# Altium project quad-voice-analog-synth.PrjPcb
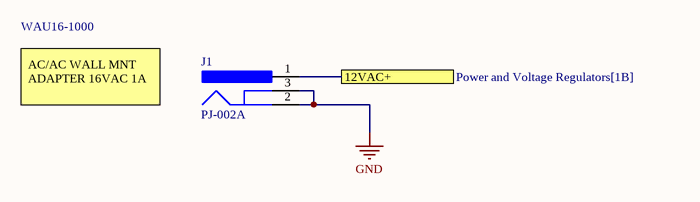
[diagram p0: Connectors.SchDoc]
4 sheets, 32 parts. Net scope: flat (ports and power ports of the same name join across sheets).
Sheets:
  Cover.SchDoc
  Connectors.SchDoc
  Power and Voltage Regulators.SchDoc
  Oscillator Core.SchDoc

## Sheet Cover.SchDoc
size A; SheetNumber: 1; SheetTotal: 1

## Sheet Connectors.SchDoc
size A; SheetNumber: 2; SheetTotal: 3

### Parts
J1  PJ-002A  [CUI-PJ-002A_V]

### Ports
12VAC+ (see Power and Voltage Regulators[1B])

### Nets
GND: J1.2 J1.3
NetD1_2: J1.1 ; port 12VAC+

### Notes on the sheet
- WAU16-1000
- AC/AC WALL MNT ADAPTER 16VAC 1A

### Library data of the parts
J1 = PJ-002A: CONN PWR JACK 2X5.5MM SOLDER; Manufacturer: CUIInc.; Connector Type: DCPowerJack; Brand: CUI; Inside Contact Diameter: 2mm; Voltage Rating: 24V; Mounting Angle: Right; Outside Contact Diameter: 6.5mm; Current Rating: 2.5A; Insulation Resistance: 50MOhms; Description: 12V, 1A, 2mm Dia; Option: General Purpose; Rated Current (Power): 1A; DIN Conformance: No; Contact Gender: Male; Datasheet Version: Rev. 1.03, 04/2016; Housing Material: PolybutyleneTerephthalate(PBT); Operating Temperature Range: -25Cto+85C; Termination Style: ThroughHole; Product Category: DCPowerConnectors; Mounting Technology: ThroughHole; Mounting Style: ThroughHole; Factory Pack Quantity: 500; Contact Plating: Nickel; Package Reference: PJ-002A; Package Description: 3-Pin Through Hole Device, Body 14.4 x 9 mm, Height 11 mm; Flammability Rating: UL94V-0; Manufacturer URL: http://www.cui.com/; Product: Jacks; Contact Material: Copper; Datasheet URL: http://www.cui.com/product/resource/pj-002a.pdf; RoHS: True; Supplier: Mouser; Supplier Part Number: 490-PJ-002A; Manufacturer Part Number: PJ-002A; Category: Uncategorized; Contact Finish - Mating: NOT SPECIFIED; Body/Shell Style: JACK; Termination: Solder; Pin Diameter: 2mm; Reach SVHC Compliant: Yes; RoHS Compliant: Yes; IEC Conformance: No; MIL Conformance: No; ComponentLink1URL: https://datasheet.ciiva.com:443/pdfs/VipMasterIC/IC/CUIS/CUIS-S-A0007606357/CUIS-S-A0007606357-1.pdf?src-supplier=IHS+Markit; ComponentLink1Description: https://datasheet.ciiva.com:443/pdfs/VipMasterIC/IC/CUIS/CUIS-S-A0007606357/CUIS-S-A0007606357-1.pdf?src-supplier=IHS+Markit; ComponentLink2URL: http://www.mouser.com/ds/2/670/pj-002a-515880.pdf?src-supplier=Mouser; ComponentLink2Description: http://www.mouser.com/ds/2/670/pj-002a-515880.pdf?src-supplier=Mouser; ComponentLink3URL: https://www.cui.com/product/resource/digikeypdf/pj-002a.pdf?src-supplier=Digikey; ComponentLink3Description: https://www.cui.com/product/resource/digikeypdf/pj-002a.pdf?src-supplier=Digikey; ComponentLink4URL: http://www.cui.com/Product/Resource/FuturePDF/PJ-002A.pdf?src-supplier=Future+Electronics; ComponentLink4Description: http://www.cui.com/Product/Resource/FuturePDF/PJ-002A.pdf?src-supplier=Future+Electronics

## Sheet Power and Voltage Regulators.SchDoc
size A; SheetNumber: 3; SheetTotal: 2
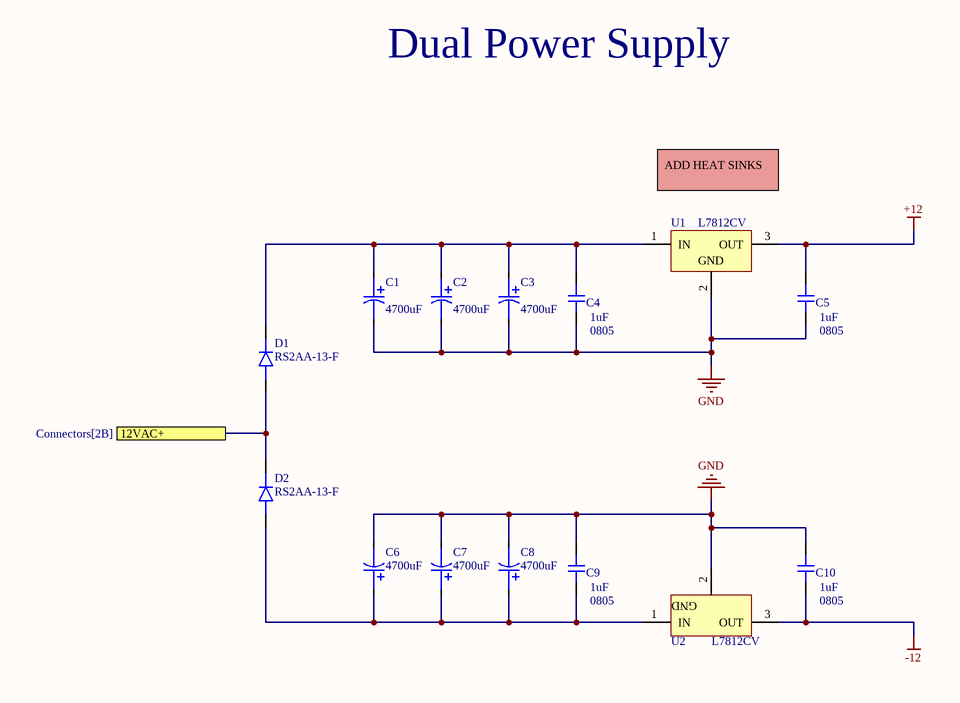
[diagram p1: Power and Voltage Regulators.SchDoc]

### Parts
C1  value 4700uF  [Radial Capacitor 7.5mm Pitch]  (hidden comment: 478CKS035M)
C2  value 4700uF  [Radial Capacitor 7.5mm Pitch]  (hidden comment: 478CKS035M)
C3  value 4700uF  [Radial Capacitor 7.5mm Pitch]  (hidden comment: 478CKS035M)
C4  value 1uF  Case/Package: 0805  [0805-CAP]  (hidden comment: Ceramic Capacitor)
C5  value 1uF  Case/Package: 0805  [0805-CAP]  (hidden comment: Ceramic Capacitor)
C6  value 4700uF  [Radial Capacitor 7.5mm Pitch]  (hidden comment: 478CKS035M)
C7  value 4700uF  [Radial Capacitor 7.5mm Pitch]  (hidden comment: 478CKS035M)
C8  value 4700uF  [Radial Capacitor 7.5mm Pitch]  (hidden comment: 478CKS035M)
C9  value 1uF  Case/Package: 0805  [0805-CAP]  (hidden comment: Ceramic Capacitor)
C10  value 1uF  Case/Package: 0805  [0805-CAP]  (hidden comment: Ceramic Capacitor)
D1  RS2AA-13-F  [DIOM4326X23N]
D2  RS2AA-13-F  [DIOM4326X23N]
U1  L7812CV  [TO220]
U2  L7812CV  [TO220]

### Ports
12VAC+ (see Connectors[2B])

### Nets
+12: C5.1 U1.3(OUT)
-12: C10.2 U2.3(OUT)
GND: C1.1 C2.1 C3.1 C4.2 C5.2 C6.1 C7.1 C8.1 C9.1 C10.1 U1.2(GND) U2.2(GND)
NetC1_2: C1.2 C2.2 C3.2 C4.1 D1.1 U1.1(IN)
NetC6_2: C6.2 C7.2 C8.2 C9.2 D2.2 U2.1(IN)
NetD1_2: D1.2 D2.1 ; port 12VAC+

### Notes on the sheet
- Dual Power Supply
- ADD HEAT SINKS

### Library data of the parts
C1-C3 C6-C8 = 478CKS035M: Aluminum Electrolytic Capacitors - Leaded 4700uF 35 Volts 20% LYTICS/IC; Manufacturer: Cornell Dubilier; Supplier: Newark; Supplier Part Number: 84M5175; Manufacturer Part Number: 478CKS035M; RoHS: Yes; Category: Capacitors; Stock: 101; Pricing: 1=1.58, 10=1.45, 25=1.45, 50=1.45, 100=1.34, 500=1.34 (USD); ComponentLink1URL: https://datasheet.ciiva.com/16317/ckr-cks-16317831.pdf?src-supplier=Future+Electronics; ComponentLink1Description: https://datasheet.ciiva.com/16317/ckr-cks-16317831.pdf?src-supplier=Future+Electronics
C4 C5 C9 C10 = Cap: Ceramic Capacitor, Multilayer, Ceramic, 50V, 10% +Tol, 10% -Tol, X7R, 15% TC, 1uF, Surface Mount, 0805; Manufacturer: Samsung; Manufacturer Part Number: CL21B105KBFNNNE; Multilayer: Yes; Supplier: Avnet; Supplier Part Number: CL21B105KBFNNNE; RoHS: Yes; Category: Ceramic Capacitors; Stock: 160000; Pricing: 2000=0.01319, 4000=0.01289, 8000=0.01258, 12000=0.01228, 16000=0.01198 (USD); Mounting Technology: Surface Mount; Pins: 2; Dielectric Material: Ceramic; Package Shape: Rectangular; Terminal Finish: Nickel; Min Operating Temperature: -55°C; Max Operating Temperature: 125°C; JESD-609 Code: e3; Capacitor Type: Ceramic; Tolerance  (fill in as +-): 10%; Package Style: SMTMeter; Packaging: Tape and Reel; Tolerance (fill in as +-): 10%; Rated DC Voltage (URdc): 50V; Temperature Characteristics Code: X7R; Termination: Wraparound; Length: 2mm; Width: 1.25mm; Height: 1.35mm; Reach SVHC Compliant: Yes; RoHS Compliant: Yes; ComponentLink1URL: https://datasheet.ciiva.com:443/pdfs/VipMasterIC/IC/SEMS/SEMS-S-A0008524728/SEMS-S-A0008523023-1.pdf?src-supplier=IHS+Markit; ComponentLink1Description: https://datasheet.ciiva.com:443/pdfs/VipMasterIC/IC/SEMS/SEMS-S-A0008524728/SEMS-S-A0008523023-1.pdf?src-supplier=IHS+Markit; ComponentLink2URL: https://media.digikey.com/pdf/Data%20Sheets/Samsung%20PDFs/CL_Series_MLCC_ds.pdf?src-supplier=Digikey; ComponentLink2Description: https://media.digikey.com/pdf/Data%20Sheets/Samsung%20PDFs/CL_Series_MLCC_ds.pdf?src-supplier=Digikey; ComponentLink3URL: http://www.farnell.com/datasheets/2710563.pdf?src-supplier=Farnell; ComponentLink3Description: http://www.farnell.com/datasheets/2710563.pdf?src-supplier=Farnell; ComponentLink4URL: https://datasheet.octopart.com/CL21B105KBFNNNE-Samsung-Electro-Mechanics-datasheet-11733377.pdf?src-supplier=Future+Electronics; ComponentLink4Description: https://datasheet.octopart.com/CL21B105KBFNNNE-Samsung-Electro-Mechanics-datasheet-11733377.pdf?src-supplier=Future+Electronics
D1 D2 = RS2AA-13-F: Rectifier Diode, 1 Phase, 1 Element, 1.5A, 50V V(RRM), Silicon; Manufacturer: Diodes; Package Body Material: Plastic; Application(s): EFFICIENCY; Forward Voltage: 1.3V; Non-rep Pk Forward Current-Max: 50A; Number of Elements: 1; Reverse Recovery Time-Max: 0.15us; Time @ Peak Reflow Temperature-Max (s): 40s; Qualification Status: Not Qualified; Supplier: Newark; Supplier Part Number: 29AK5192; Manufacturer Part Number: RS2AA-13-F; RoHS: Yes; Category: Rectifier Diodes; Stock: 4870; Pricing: 5=0.381, 10=0.303, 25=0.264, 50=0.226, 100=0.187, 250=0.181, 500=0.175, 1000=0.124 (USD); Pins: 2; Diode Element Material: SILICON; Package Shape: Rectangular; Terminal Finish: Tin; Min Operating Temperature: -65°C; Max Operating Temperature: 150°C; JESD-609 Code: e3; Diode Type: RECTIFIER; JESD-30 Code: R-PDSO-C2; Moisture Sensitivity Level: 1; Number of Phases: 1; Max Output current: 1.5A; Package Style: SMALL OUTLINEMeter; Peak Reflow Temperature (Cel): 260°C; Rep Pk Reverse Voltage-Max: 50V; Surface Mount: Yes; Terminal Form: C BEND; Terminal Position: DUAL; RoHS Compliant: Yes; Reach SVHC Compliant: No; ComponentLink1URL: https://datasheet.ciiva.com:443/pdfs/VipMasterIC/IC/DIOD/DIODS13030/DIODS13030-1.pdf?src-supplier=IHS+Markit; ComponentLink1Description: https://datasheet.ciiva.com:443/pdfs/VipMasterIC/IC/DIOD/DIODS13030/DIODS13030-1.pdf?src-supplier=IHS+Markit; ComponentLink2URL: https://datasheet.ciiva.com/16483/ds15004-16483689.pdf?src-supplier=Future+Electronics; ComponentLink2Description: https://datasheet.ciiva.com/16483/ds15004-16483689.pdf?src-supplier=Future+Electronics
U1 U2 = L7812CV: Fixed Positive Standard Regulator, 12VBIPolar, PSFM3; Manufacturer: STMicroelectronics; Max Supply Voltage: 30V; Min Input Voltage: 14.5V; Channels: 1; Output Current1-Max: 1.5A; Output Voltage1-Max: 12.6V; Output Voltage1-Min: 11.4V; Output Voltage1-Nom: 12V; Regulator Type: FIXED POSITIVE SINGLE OUTPUT STANDARD REGULATOR; Surface Mount: No; Qualification Status: Not Qualified; PackageDescription: TO, Thru-Hole, Vertical, Heatsink Mounted; 3 In-Line Leads; Pitch 2.54 mm; ComponentLink3URL: http://www.st.com/internet/com/TECHNICAL_RESOURCES/TECHNICAL_LITERATURE/PACKAGE_INFORMATION/CD00004649.pdf; ComponentLink1URL: http://www.st.com; ComponentLink2Description: Datasheet; ComponentLink3Description: Package Specification; ComponentLink2URL: http://www.st.com/internet/com/TECHNICAL_RESOURCES/TECHNICAL_LITERATURE/DATASHEET/CD00000444.pdf; DatasheetVersion: 16/11/2011; PackageVersion: ver3.0; PackageReference: TO220; ComponentLink1Description: Manufacturer URL; Supplier: Mouser; Supplier Part Number: 511-L7812CV; Manufacturer Part Number: L7812CV; RoHS: Yes; Category: Voltage Regulators - Linear; Stock: 31967; Pricing: 1=0.6, 10=0.465, 50=0.465, 100=0.401, 250=0.381, 500=0.339, 1000=0.289, 2000=0.264, 5000=0.259, 10000=0.258 (USD); Pins: 3; Package Shape: Rectangular; Terminal Finish: Tin; JESD-609 Code: e3; Operating Temperature, TJ-Max: 125°C; Operating Temperature, TJ-Min: 0°C; Package Style: FLANGE MOUNTMeter; Technology: BIPOLAR; Terminal Form: Through Hole; Terminal Position: SINGLE; RoHS Compliant: Yes; Reach SVHC Compliant: No; ComponentLink4URL: https://datasheet.ciiva.com:443/pdfs/VipMasterIC/IC/SGST/SGST-S-A0006334694/SGST-S-A0006334694-1.pdf?src-supplier=IHS+Markit; ComponentLink4Description: https://datasheet.ciiva.com:443/pdfs/VipMasterIC/IC/SGST/SGST-S-A0006334694/SGST-S-A0006334694-1.pdf?src-supplier=IHS+Markit; ComponentLink5URL: https://datasheet.ciiva.com/19456/889305-19456372.pdf?src-supplier=Jameco; ComponentLink5Description: https://datasheet.ciiva.com/19456/889305-19456372.pdf?src-supplier=Jameco; ComponentLink6URL: https://datasheet.ciiva.com/15111/getdatasheetpartid-93787-15111629.pdf?src-supplier=Verical; ComponentLink6Description: https://datasheet.ciiva.com/15111/getdatasheetpartid-93787-15111629.pdf?src-supplier=Verical; ComponentLink7URL: https://datasheet.ciiva.com/29156/156053-da-01-en-spannungsregler-l7812cv-to220-stm-29156878.pdf?src-supplier=Conrad; ComponentLink7Description: https://datasheet.ciiva.com/29156/156053-da-01-en-spannungsregler-l7812cv-to220-stm-29156878.pdf?src-supplier=Conrad; ComponentLink8URL: https://datasheet.ciiva.com/29157/179230-da-01-en-spannungsregler-ic-l7812cv-to-220-stm-29157837.pdf?src-supplier=Conrad; ComponentLink8Description: https://datasheet.ciiva.com/29157/179230-da-01-en-spannungsregler-ic-l7812cv-to-220-stm-29157837.pdf?src-supplier=Conrad; ComponentLink9URL: https://datasheet.ciiva.com/14111/tel78xx-l78xxc-e-14111397.pdf?src-supplier=Distrelec; ComponentLink9Description: https://datasheet.ciiva.com/14111/tel78xx-l78xxc-e-14111397.pdf?src-supplier=Distrelec; ComponentLink10URL: https://datasheet.ciiva.com/6884/1805459-6884955.pdf?src-supplier=Newark; ComponentLink10Description: https://datasheet.ciiva.com/6884/1805459-6884955.pdf?src-supplier=Newark; ComponentLink11URL: https://datasheet.ciiva.com/1511/1805459-1511927.pdf?src-supplier=Element14; ComponentLink11Description: https://datasheet.ciiva.com/1511/1805459-1511927.pdf?src-supplier=Element14; ComponentLink12URL: https://datasheet.ciiva.com/16508/cd00000444-16508249.pdf?src-supplier=Future+Electronics; ComponentLink12Description: https://datasheet.ciiva.com/16508/cd00000444-16508249.pdf?src-supplier=Future+Electronics

## Sheet Oscillator Core.SchDoc
size A; SheetNumber: 4; SheetTotal: 4
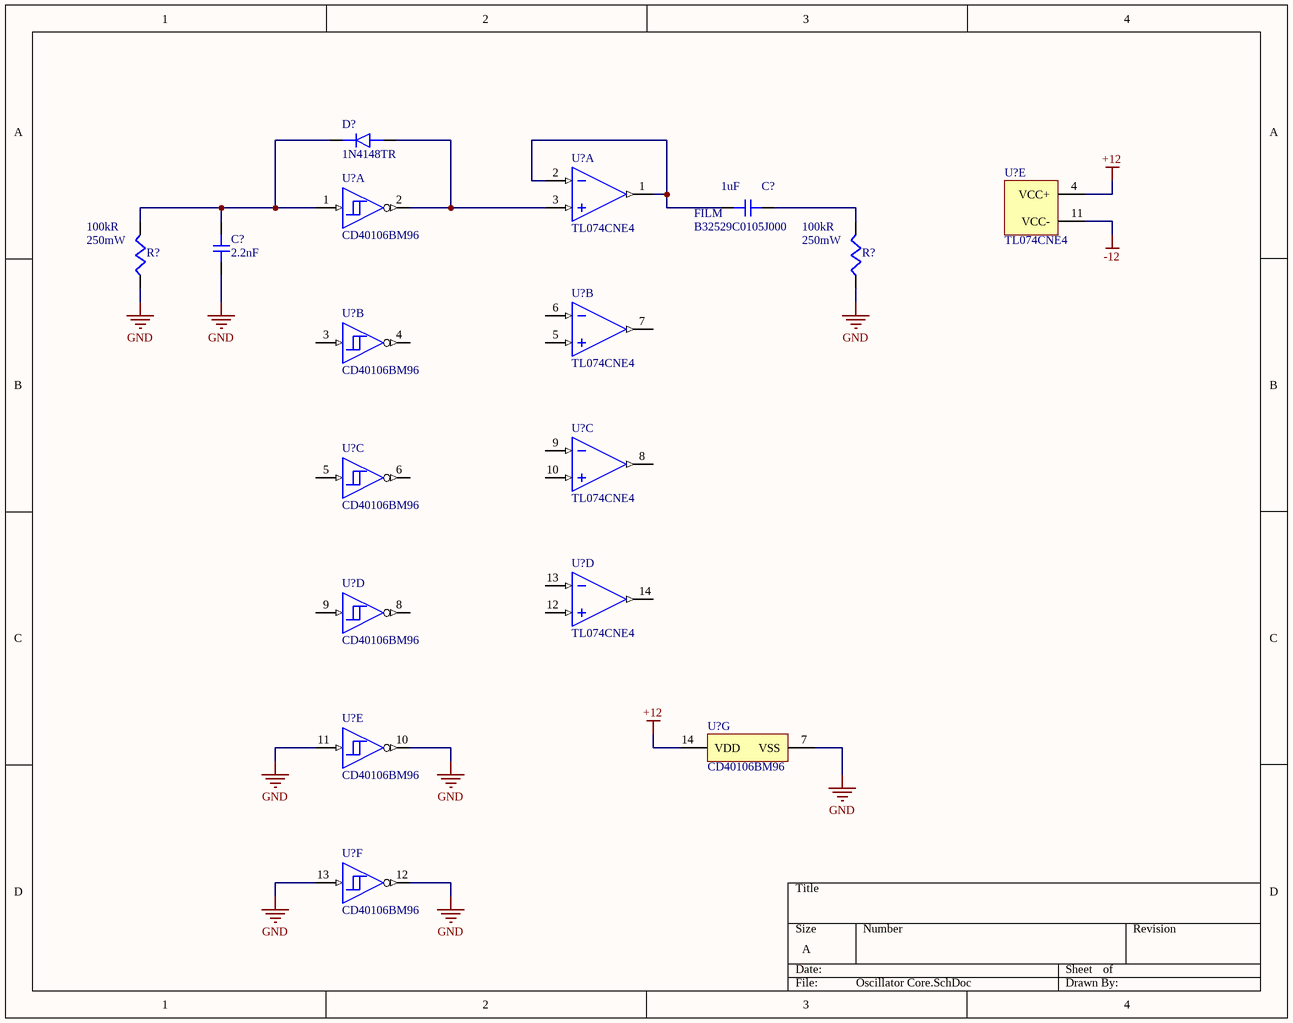
[diagram p2: Oscillator Core.SchDoc]

### Parts
(Parts that share a designator on the sheet are numbered #1, #2 ... from top to bottom, then left to right.)
C?#1  value 1uF  Manufacturer Part Number: B32529C0105J000  Capacitor Type: FILM  [0201-CAP]  (hidden comment: Ceramic Capacitor)
C?#2  value 2.2nF  [Cap Radial - PHE850EA4220MA01R17]  (hidden comment: Ceramic Capacitor)
D?  1N4148TR  [Diode 1N4148TR]
R?#1  value 100kR  Power: 250mW  [AXIAL - 07.4mm Length]  (hidden comment: Res)
R?#2  value 100kR  Power: 250mW  [AXIAL - 07.4mm Length]  (hidden comment: Res)
U?#1  TL074CNE4  [TL074CN]  (part A of 5)
U?#2  CD40106BM96  [CD40106BM96]  (part A of 7)
U?#3  TL074CNE4  [TL074CN]  (part E of 5)
U?#4  TL074CNE4  [TL074CN]  (part B of 5)
U?#5  CD40106BM96  [CD40106BM96]  (part B of 7)
U?#6  TL074CNE4  [TL074CN]  (part C of 5)
U?#7  CD40106BM96  [CD40106BM96]  (part C of 7)
U?#8  TL074CNE4  [TL074CN]  (part D of 5)
U?#9  CD40106BM96  [CD40106BM96]  (part D of 7)
U?#10  CD40106BM96  [CD40106BM96]  (part E of 7)
U?#11  CD40106BM96  [CD40106BM96]  (part G of 7)
U?#12  CD40106BM96  [CD40106BM96]  (part F of 7)

### Nets
+12: U?#3.4(VCC+) U?#11.14(VDD)
-12: U?#3.11(VCC-)
GND: C?#2.1 R?#1.2 R?#2.2 U?#10.10(K=~{E}) U?#10.11(E) U?#11.7(VSS) U?#12.12(L=~{F}) U?#12.13(F)
NetC?#1_1: C?#1.1 U?#1.1(OUT1) U?#1.2(IN1-)
NetC?#1_2: C?#1.2 R?#2.1
NetC?#2_2: C?#2.2 D?.1(C) R?#1.1 U?#2.1(A)
NetD?_2: D?.2(A) U?#1.3(IN1+) U?#2.2(G=~{A})

Not connected (* = marked no-connect by the designer): U?#4 5(IN2+) 6(IN2-) 7(OUT2); U?#5 3(B) 4(H=~{B}); U?#6 8(OUT3) 9(IN3-) 10(IN3+); U?#7 5(C) 6(I=~{C}); U?#8 12(IN4+) 13(IN4-) 14(OUT4); U?#9 8(J=~{D}) 9(D)

### Library data of the parts
C?#1 = Cap: Film Capacitor, Polyester And Polyethylene Terephthalate, 63V, 5% +Tol, 5% -Tol, 1uF, Through Hole Mount; Manufacturer: TDK EPCOS; Rated AC Voltage (URac): 40V; Supplier: Arrow Electronics; Supplier Part Number: B32529C0105J000; RoHS: Yes; Category: Film Capacitors; Stock: 6189; Pricing: 1=0.185, 10=0.1831, 50=0.1813, 100=0.1795, 500=0.1711, 1500=0.1699, 3000=0.1637, 6000=0.1625 (USD); Mounting Technology: Through Hole; Pins: 2; Dielectric Material: Polyester; Package Shape: Rectangular; Case/Package: 2918; Terminal Finish: Tin; Min Operating Temperature: -55°C; Max Operating Temperature: 85°C; JESD-609 Code: e3; Tolerance  (fill in as +-): 5%; Package Style: RadialMeter; Packaging: Bulk; Tolerance (fill in as +-): 5%; Rated DC Voltage (URdc): 63V; Termination: Wire; Length: 7.3mm; Width: 4.5mm; Height: 9.5mm; Terminal Pitch: 5mm; Reach SVHC Compliant: Yes; RoHS Compliant: Yes; ComponentLink1URL: https://datasheet.ciiva.com:443/pdfs/VipMasterIC/IC/TDKC/TDKC-S-A0008208241/TDKC-S-A0008208241-1.pdf?src-supplier=IHS+Markit; ComponentLink1Description: https://datasheet.ciiva.com:443/pdfs/VipMasterIC/IC/TDKC/TDKC-S-A0008208241/TDKC-S-A0008208241-1.pdf?src-supplier=IHS+Markit; ComponentLink2URL: https://datasheet.ciiva.com/48779/1756148-48779390.pdf?src-supplier=Element14; ComponentLink2Description: https://datasheet.ciiva.com/48779/1756148-48779390.pdf?src-supplier=Element14
C?#2 = Cap Film - PHE850EA4220MA01R17: Film Capacitor, Polypropylene, 1250V, 20% +Tol, 20% -Tol, 0.0022uF, Through Hole Mount, 5116; Manufacturer: KEMET; Rated AC Voltage (URac): 300V; Rated DC Voltage (URdc): 1.25kV; Supplier: Digikey; Supplier Part Number: 399-5416-ND; Manufacturer Part Number: PHE850EA4220MA01R17; RoHS: Yes; Category: Film Capacitors; Stock: 9606; Pricing: 1=0.55, 10=0.37, 50=0.2944, 100=0.243, 500=0.18988, 1000=0.1614, 3000=0.1519, 5000=0.14241 (USD); Mounting Technology: Through Hole; Pins: 2; Dielectric Material: Polypropylene; Package Shape: Rectangular; Case/Package: 5116; Min Operating Temperature: -55°C; Max Operating Temperature: 110°C; Capacitor Type: FILM; Tolerance  (fill in as +-): 20%; Package Style: RadialMeter; Packaging: Bulk; Tolerance (fill in as +-): 20%; Termination: Wire; Length: 13mm; Width: 4mm; Height: 9mm; Terminal Pitch: 10mm; Reach SVHC Compliant: Yes; RoHS Compliant: Yes; ComponentLink1URL: http://capacitoredge.kemet.com:80/capedge2/DataSheet/Datasheet-F850AG222M300A.pdf?pn=F850AG222M300A&src-supplier=IHS+Markit; ComponentLink1Description: http://capacitoredge.kemet.com:80/capedge2/DataSheet/Datasheet-F850AG222M300A.pdf?pn=F850AG222M300A&src-supplier=IHS+Markit; ComponentLink2URL: https://datasheet.ciiva.com/11791/0900766b807a221a-11791184.pdf?src-supplier=Rs; ComponentLink2Description: https://datasheet.ciiva.com/11791/0900766b807a221a-11791184.pdf?src-supplier=Rs; ComponentLink3URL: https://datasheet.ciiva.com/26822/getdatasheetpartid-292550-26822588.pdf?src-supplier=Verical; ComponentLink3Description: https://datasheet.ciiva.com/26822/getdatasheetpartid-292550-26822588.pdf?src-supplier=Verical; ComponentLink4URL: https://datasheet.ciiva.com/241/f3294-phe850-241384.pdf?src-supplier=Digikey; ComponentLink4Description: https://datasheet.ciiva.com/241/f3294-phe850-241384.pdf?src-supplier=Digikey; ComponentLink5URL: https://datasheet.ciiva.com/8031/629954-8031387.pdf?src-supplier=Element14; ComponentLink5Description: https://datasheet.ciiva.com/8031/629954-8031387.pdf?src-supplier=Element14; ComponentLink6URL: https://datasheet.ciiva.com/14111/bbphe850-data-e-14111198.pdf?src-supplier=Distrelec; ComponentLink6Description: https://datasheet.ciiva.com/14111/bbphe850-data-e-14111198.pdf?src-supplier=Distrelec
D? = Diode 1N4148TR: DIODE GEN PURP 100V 200MA DO35; Manufacturer: ON Semiconductor; Peak Reverse Current: 5uA; Value: 4pF; Max Junction Temp: +175°C; Max Surge Forward Current: 1A; Footprint Url: https://www.onsemi.com/pub/Collateral/017AG.PDF; Temperature Range Low: -55°C; Max Repetitive Reverse Voltage: 100V; Temperature Range High: +175°C; Reverse Voltage: 100V; ComponentLink2URL: https://www.onsemi.com/pub/Collateral/1N914A-D.pdf; Category: Diode; Package: 017AG; Octopart: https://octopart.com/1n4148tr-on+semiconductor-84323125; Device Class L1: Discrete Semiconductors; Manufacturer Part Number: 1N4148TR; Forward Current: 200mA; Temperature: -55°C to +175°C; Lead Free: Yes; Digikey Description: DIODE GEN PURP 100V 200MA DO35; Mouser Description: 1N4148 Series 100 V 500 mW Small Signal Fast Switching Diode - DO-35; Automotive: No; Device Class L2: Diodes; Device Class L3: Rectifier Diodes; Height: 1.91mm; ComponentLink2Description: Datasheet; RoHS: TRUE; Capacitance: 4pF
R?#1 R?#2 = Res: Fixed Resistor, Metal Film, 0.25W, 100000ohm, 250V, 0.1% +/-Tol, 25ppm/Cel, Through Hole Mount; Manufacturer: Stackpole Electronics; Manufacturer Part Number: RNF14BTE100K; Additional Feature: FLAME PROOF; Rated Temperature: 70°C; Temperature Coefficient: 25ppm/°C; Lead Diameter: 0.56mm; Package Diameter: 2.35mm; Package Length: 6.35mm; Supplier: Arrow Electronics; Supplier Part Number: RNF14BTE100K; RoHS: Yes; Category: Through-Hole Resistors; Stock: 4170; Pricing: 706=0.1448, 1000=0.1429, 3000=0.1409 (USD); Mounting Technology: Through Hole; Pins: 2; Terminal Finish: Tin; Min Operating Temperature: -55°C; Max Operating Temperature: 155°C; Tolerance: 0.1%; JESD-609 Code: e3; Resistor Type: FIXED RESISTOR; Construction: Tubular; Package Style: AxialMeter; Packaging: Tape and Reel; Technology: METAL FILM; Termination: Wire; Working Voltage: 250V; Reach SVHC Compliant: Yes; RoHS Compliant: Yes; ComponentLink1URL: https://datasheet.ciiva.com:443/pdfs/VipMasterIC/IC/SEIE/SEIE-S-A0004433080/SEIE-S-A0004433080-1.pdf?src-supplier=IHS+Markit; ComponentLink1Description: https://datasheet.ciiva.com:443/pdfs/VipMasterIC/IC/SEIE/SEIE-S-A0004433080/SEIE-S-A0004433080-1.pdf?src-supplier=IHS+Markit; ComponentLink2URL: https://www.seielect.com/catalog/SEI-Packaging.pdf?src-supplier=Digikey; ComponentLink2Description: https://www.seielect.com/catalog/SEI-Packaging.pdf?src-supplier=Digikey; ComponentLink3URL: https://www.seielect.com/Catalog/SEI-RNF_RNMF.pdf?src-supplier=Avnet; ComponentLink3Description: https://www.seielect.com/Catalog/SEI-RNF_RNMF.pdf?src-supplier=Avnet; ComponentLink4URL: https://datasheet.octopart.com/RNF14BTE100K-Stackpole-Electronics-datasheet-12510179.pdf?src-supplier=Future+Electronics; ComponentLink4Description: https://datasheet.octopart.com/RNF14BTE100K-Stackpole-Electronics-datasheet-12510179.pdf?src-supplier=Future+Electronics
U?#1 U?#3 U?#4 U?#6 U?#8 = TL074CN: Quad Low-Noise JFET-Input General-Purpose Operational Amplifier, 7 to 36 V, 0 to 70 degC, 14-pin DIP (N14), Pb-Free (RoHS); Manufacturer: Texas Instruments; Iq per channel(Max)(mA): 2.5; Total Supply Voltage(Max)(+5V is 5, +/-5V is 10): 36; GBW(Typ)(MHz): 3; Number of Channels: 4; Sub Family: General Purpose Amplifier, High Supply Voltage Amplifier (>=30V); CMRR(Min)(dB): 70; Slew Rate(Typ)(V/us): 13; IIB(Max)(pA): 200; Offset Drift(Typ)(uV/C): 18; Rating: Military; Vio (25C)(Max)(mV): 10; Total Supply Voltage(Min)(+5V is 5, +/-5V is 10): 7; PackageVersion: 4040049/E, 12/2002; DatasheetVersion: SLOS080J; Code_JEDEC: MS-001; PackageReference: N14; ComponentLink1Description: Manufacturer URL; Mounting Technology: Through Hole; PartNumber: TL074CNE4; ComponentLink2URL: http://www.ti.com/lit/ds/symlink/tl074.pdf; ComponentLink1URL: http://www.ti.com/; PackageDescription: 14-Pin Plastic In-Line, Body 19.305 x 6.35 mm, Pitch 2.54 mm; ComponentLink2Description: Datasheet; Eco-Plan: Pb-Free (RoHS); Vn at 1kHz(Typ)(nV/rtHz): 18; ComponentLink3URL: http://www.ti.com/lit/ml/mpdi002c/mpdi002c.pdf; ComponentLink3Description: Package Specification
U?#2 U?#5 U?#7 U?#9-U?#12 = CD40106 Schmitt Trigger: CMOS Hex Schmitt Triggers, D0014A, LARGE T&R; Manufacturer: Texas Instruments; Technology Family: CD4000; Voltage(Nom)(V): 5; ICC @ Nom Voltage(Max)(mA): 0.03; tpd @ Nom Voltage(Max)(ns): 280; Rating: Catalog; Schmitt Trigger: Yes; Output Drive (IOL/IOH)(Max)(mA): -1/1; VCC(Max)(V): 18; F @ Nom Voltage(Max)(Mhz): 12; Bits(#): 6; VCC(Min)(V): 3; Code_JEDEC: MS-012; PackageReference: D0014A; Output Type: CMOS; Generic Part Number: CD40106B; Operating Temperature Range(C): -55 to 125; Input Type: CMOS; DatasheetVersion: SCHS097D

## Nets that join several sheets
+12: Power and Voltage Regulators (C5.1 U1.3), Oscillator Core (U?#3.4 U?#11.14)
-12: Power and Voltage Regulators (C10.2 U2.3), Oscillator Core (U?#3.11)
GND: Connectors (J1.2 J1.3), Power and Voltage Regulators (12 pins), Oscillator Core (8 pins)
NetD1_2: Connectors (J1.1), Power and Voltage Regulators (D1.2 D2.1)